# EasyEDA schematic My-VONE-6502 Hex Display 8 Data& 16 Adress Bits_2021-02-14_09-02-12.json
TITLE: Hex Display & KeyBoard 8 Data & 16 Adress Bits; REV: 1.0; Date: 2020-05-04; Sheet: 1/1; Drawn By: Termineric; Company: TerminEric
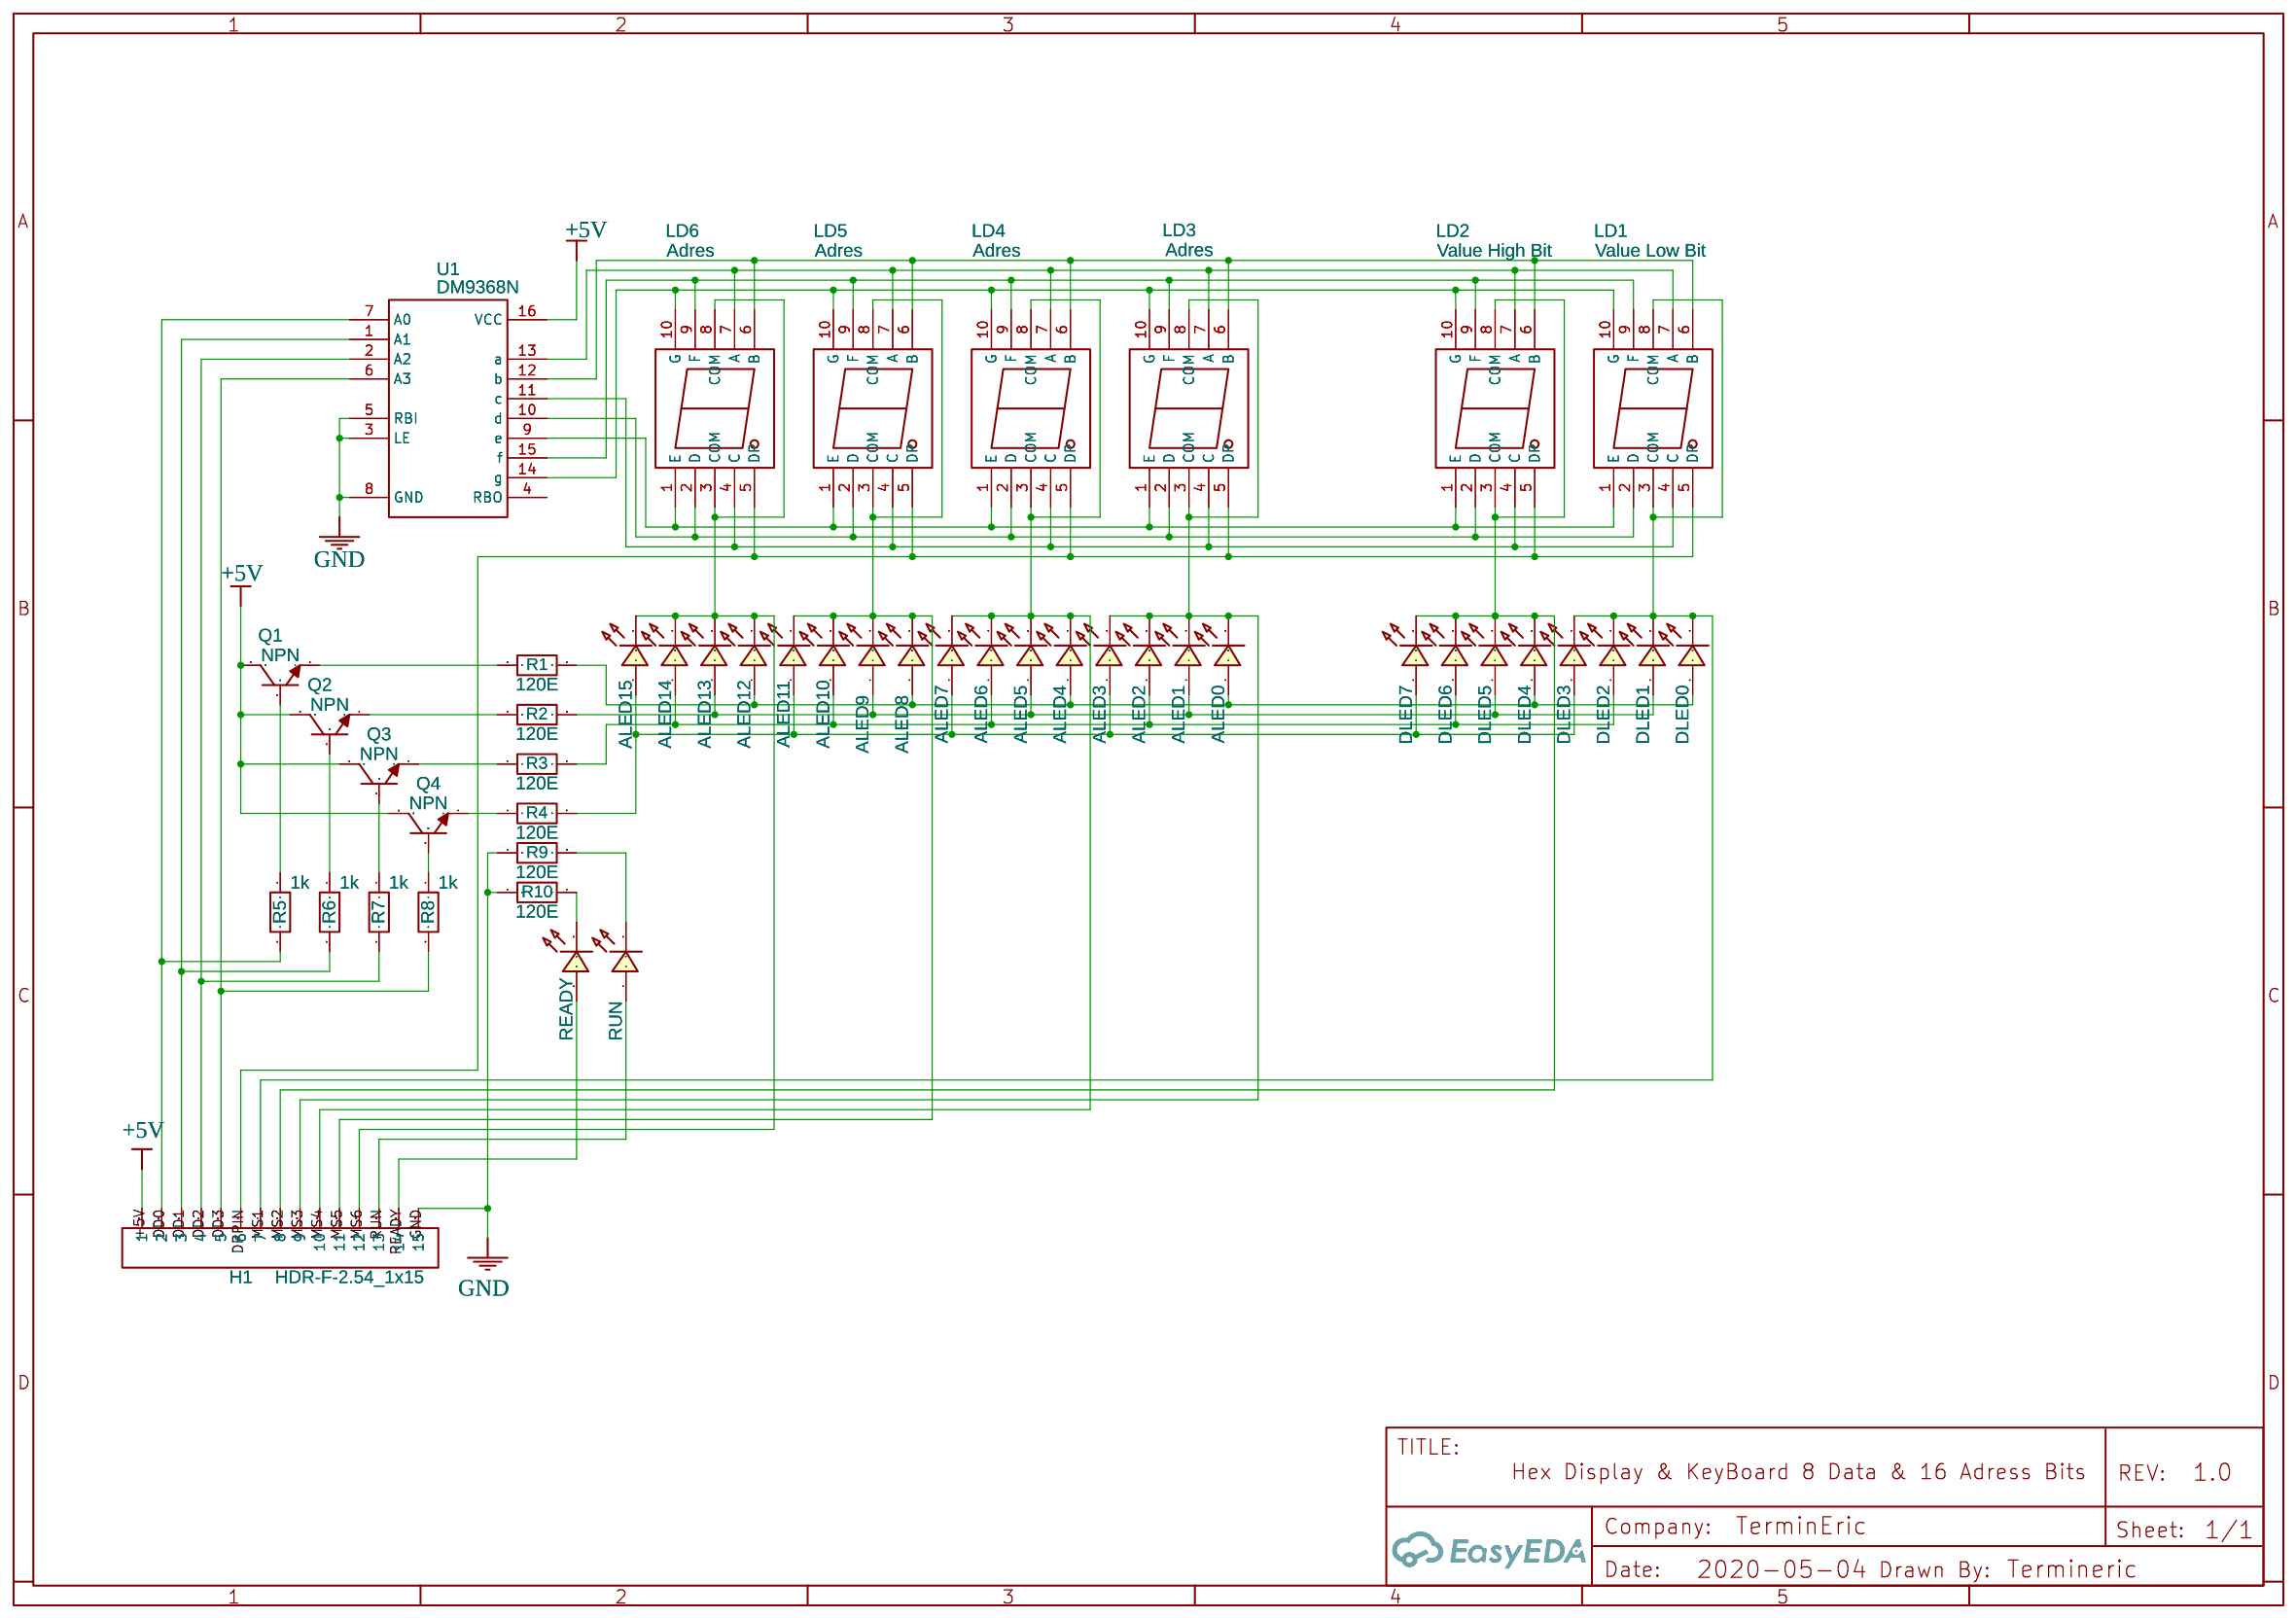
[diagram p0: schematic sheet]

## Parts
ALED0  A0  [LED-TH_2A5R2UC12]
ALED1  A1  [LED-TH_2A5R2UC12]
ALED2  A2  [LED-TH_2A5R2UC12]
ALED3  A3  [LED-TH_2A5R2UC12]
ALED4  A4  [LED-TH_2A5R2UC12]
ALED5  A5  [LED-TH_2A5R2UC12]
ALED6  A6  [LED-TH_2A5R2UC12]
ALED7  A7  [LED-TH_2A5R2UC12]
ALED8  A8  [LED-TH_2A5R2UC12]
ALED9  A9  [LED-TH_2A5R2UC12]
ALED10  A10  [LED-TH_2A5R2UC12]
ALED11  A11  [LED-TH_2A5R2UC12]
ALED12  A12  [LED-TH_2A5R2UC12]
ALED13  A13  [LED-TH_2A5R2UC12]
ALED14  A14  [LED-TH_2A5R2UC12]
ALED15  A15  [LED-TH_2A5R2UC12]
DLED0  D0  [LED-TH_2A5R2UC12]
DLED1  D1  [LED-TH_2A5R2UC12]
DLED2  D2  [LED-TH_2A5R2UC12]
DLED3  D3  [LED-TH_2A5R2UC12]
DLED4  D4  [LED-TH_2A5R2UC12]
DLED5  D5  [LED-TH_2A5R2UC12]
DLED6  D6  [LED-TH_2A5R2UC12]
DLED7  D7  [LED-TH_2A5R2UC12]
H1  HDR-F-2.54_1x15  [HDR-F-2.54_1X15]
LD1  Value Low Bit  [LED-SEG-TH_SLR0561DBA1BD]
LD2  Value High Bit  [LED-SEG-TH_SLR0561DBA1BD]
LD3  Adres  [LED-SEG-TH_SLR0561DBA1BD]
LD4  Adres  [LED-SEG-TH_SLR0561DBA1BD]
LD5  Adres  [LED-SEG-TH_SLR0561DBA1BD]
LD6  Adres  [LED-SEG-TH_SLR0561DBA1BD]
Q1  NPN  [TO-92(TO-92-3)]
Q2  NPN  [TO-92(TO-92-3)]
Q3  NPN  [TO-92(TO-92-3)]
Q4  NPN  [TO-92(TO-92-3)]
R1  120E  [R_AXIAL-0.3]
R2  120E  [R_AXIAL-0.3]
R3  120E  [R_AXIAL-0.3]
R4  120E  [R_AXIAL-0.3]
R5  1k  [AXIAL-0.3]
R6  1k  [AXIAL-0.3]
R7  1k  [AXIAL-0.3]
R8  1k  [AXIAL-0.3]
R9  120E  [R_AXIAL-0.3]
R10  120E  [R_AXIAL-0.3]
READY  A15  [LED-TH_2A5R2UC12]
RUN  A15  [LED-TH_2A5R2UC12]
U1  DM9368N  [DIP16]

## Library data of the parts
ALED0-ALED15 DLED0-DLED7 READY RUN = LED-0603_R: Contributor: LCEDA_01; Package Display: No
H1 = HDR-F-2.54_1x15: Supplier Part: C124408; Supplier: LCSC; Contributor: LCEDA_Lib
LD1 LD2 LD4-LD6 = -: Supplier: LCSC; Supplier Part: C225938; Manufacturer: SUNLIGHT; Manufacturer Part: SLR0561DBA1BD; Contributor: LCSC
LD3 = -: Supplier: Add New Supplier; Supplier Part: SC 52-11 RT; Manufacturer Part: SLR0561DBA1BD; Contributor: LCSC; Manufacturer: KINGBRIGHT
Q1-Q4 = -: Supplier: LCSC; Manufacturer: SEMTECH; Manufacturer Part: 2N3904; Supplier Part: C118538
R1-R4 R9 R10 = R_0201_EU: Contributor: LCEDA_Lib
R5-R8 = Res_AXIAL-0.3(1/8W)_EU
U1 = DM9368N: 7-Segment DecoderDriverLatch with Constant Current Source Outputs

## Nets
+5V: H1.1 Q1.3(C) Q2.3(C) Q3.3(C) Q4.3(C) U1.16(VCC)
GND: H1.15 R9.1 R10.1 U1.3(LE) U1.5(RBI) U1.8(GND)
DD0: H1.2 R5.2 U1.7(A0)
DD1: H1.3 R6.2 U1.1(A1)
DD2: H1.4 R7.2 U1.2(A2)
DD3: H1.5 R8.2 U1.6(A3)
DPPIN: H1.6 LD1.5(DP) LD2.5(DP) LD3.5(DP) LD4.5(DP) LD5.5(DP) LD6.5(DP)
MS1: DLED0.2 DLED1.2 DLED2.2 DLED3.2 H1.7 LD1.3(COM) LD1.8(COM)
MS2: DLED4.2 DLED5.2 DLED6.2 DLED7.2 H1.8 LD2.3(COM) LD2.8(COM)
MS3: ALED0.2 ALED1.2 ALED2.2 ALED3.2 H1.9 LD3.3(COM) LD3.8(COM)
MS4: ALED4.2 ALED5.2 ALED6.2 ALED7.2 H1.10 LD4.3(COM) LD4.8(COM)
MS5: ALED8.2 ALED9.2 ALED10.2 ALED11.2 H1.11 LD5.3(COM) LD5.8(COM)
MS6: ALED12.2 ALED13.2 ALED14.2 ALED15.2 H1.12 LD6.3(COM) LD6.8(COM)
READY: H1.14 READY.1
RUN: H1.13 RUN.1
Net-(ALED0-1): ALED0.1 ALED4.1 ALED8.1 ALED12.1 DLED0.1 DLED4.1 R1.2
Net-(ALED1-1): ALED1.1 ALED5.1 ALED9.1 ALED13.1 DLED1.1 DLED5.1 R2.2
Net-(ALED2-1): ALED2.1 ALED6.1 ALED10.1 ALED14.1 DLED2.1 DLED6.1 R3.2
Net-(ALED3-1): ALED3.1 ALED7.1 ALED11.1 ALED15.1 DLED3.1 DLED7.1 R4.2
Net-(LD1-1): LD1.1(E) LD2.1(E) LD3.1(E) LD4.1(E) LD5.1(E) LD6.1(E) U1.9(e)
Net-(LD1-2): LD1.2(D) LD2.2(D) LD3.2(D) LD4.2(D) LD5.2(D) LD6.2(D) U1.10(d)
Net-(LD1-4): LD1.4(C) LD2.4(C) LD3.4(C) LD4.4(C) LD5.4(C) LD6.4(C) U1.11(c)
Net-(LD1-6): LD1.6(B) LD2.6(B) LD3.6(B) LD4.6(B) LD5.6(B) LD6.6(B) U1.12(b)
Net-(LD1-7): LD1.7(A) LD2.7(A) LD3.7(A) LD4.7(A) LD5.7(A) LD6.7(A) U1.13(a)
Net-(LD1-9): LD1.9(F) LD2.9(F) LD3.9(F) LD4.9(F) LD5.9(F) LD6.9(F) U1.15(f)
Net-(LD1-10): LD1.10(G) LD2.10(G) LD3.10(G) LD4.10(G) LD5.10(G) LD6.10(G) U1.14(g)
Net-(Q1-1): Q1.1(E) R1.1
Net-(Q1-2): Q1.2(B) R5.1
Net-(Q2-1): Q2.1(E) R2.1
Net-(Q2-2): Q2.2(B) R6.1
Net-(Q3-1): Q3.1(E) R3.1
Net-(Q3-2): Q3.2(B) R7.1
Net-(Q4-1): Q4.1(E) R4.1
Net-(Q4-2): Q4.2(B) R8.1
Net-(R9-2): R9.2 RUN.2
Net-(R10-2): R10.2 READY.2

Not connected (* = marked no-connect by the designer): U1 4(RBO)
